# Altium schematic sheet EEG AFE Sheet.SchDoc
size 381 x 241 mm; SheetNumber: 1; SheetTotal: 3
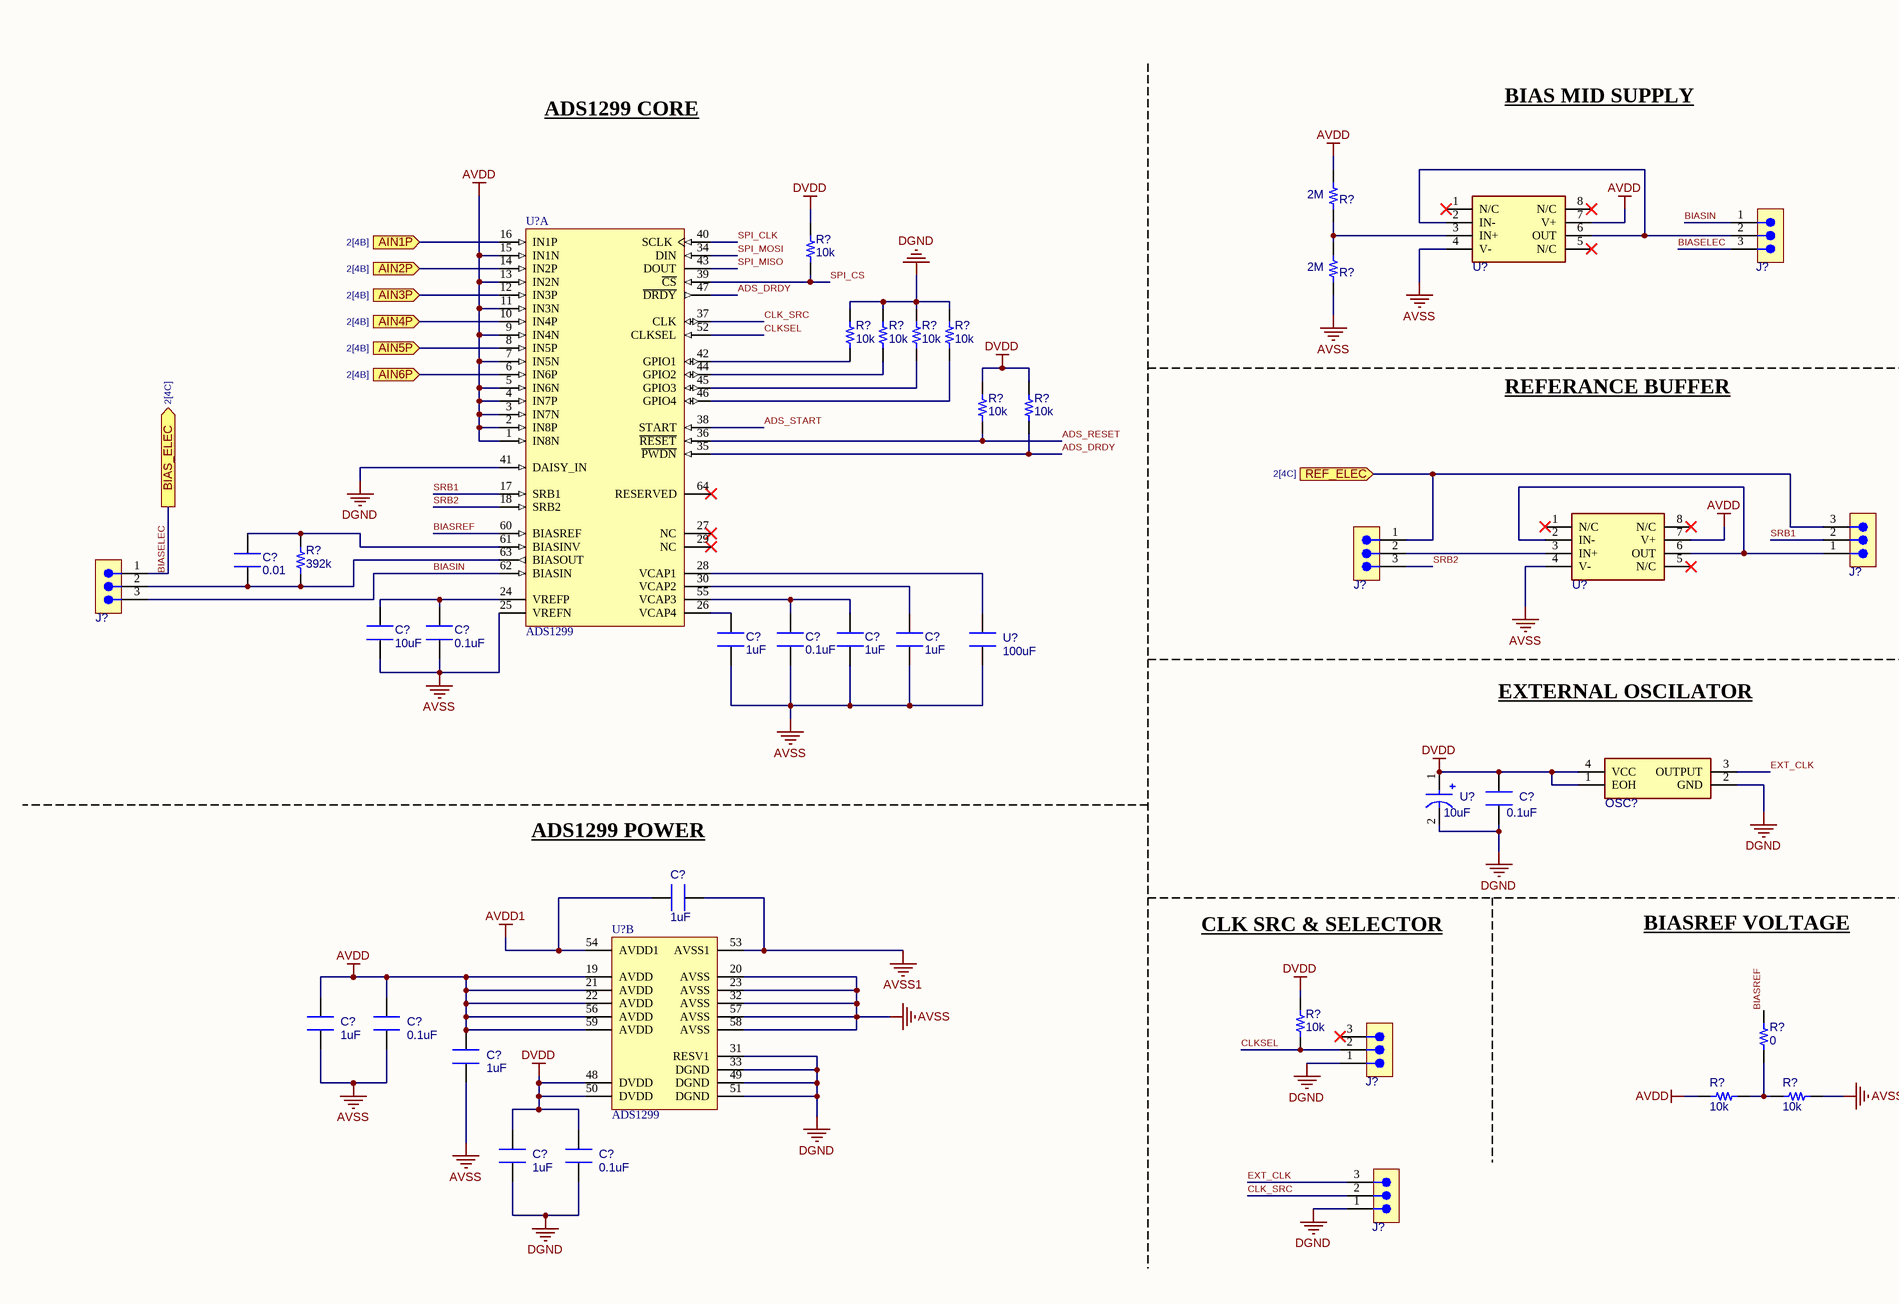
[diagram p0: EEG AFE Sheet.SchDoc, left]
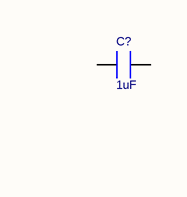
[diagram p1: EEG AFE Sheet.SchDoc, right]

## Parts
(Parts that share a designator on the sheet are numbered #1, #2 ... from top to bottom, then left to right.)
C?#1  1uF  [CAP0805]
C?#2  0.01  [CAP0805]
C?#3  10uF  [CAP0805]
C?#4  0.1uF  [CAP0805]
C?#5  1uF  [CAP0805]
C?#6  0.1uF  [CAP0805]
C?#7  1uF  [CAP0805]
C?#8  1uF  [CAP0805]
C?#9  0.1uF  [CAP0805]
C?#10  1uF  [CAP0805]
C?#11  1uF  [CAP0805]
C?#12  0.1uF  [CAP0805]
C?#13  1uF  [CAP0805]
C?#14  1uF  [CAP0805]
C?#15  0.1uF  [CAP0805]
J?#1  *  [SMTC-TSW-103-07-X-S]  (value not drawn)
J?#2  *  [SMTC-TSW-103-07-X-S]  (value not drawn)
J?#3  *  [SMTC-TSW-103-07-X-S]  (value not drawn)
J?#4  *  [SMTC-TSW-103-07-X-S]  (value not drawn)
J?#5  *  [SMTC-TSW-103-07-X-S]  (value not drawn)
J?#6  *  [SMTC-TSW-103-07-X-S]  (value not drawn)
OSC?  *  [632L3I002M04800]  (value not drawn)
R?#1  2M  [RES0805]
R?#2  10k  [RES0805]
R?#3  2M  [RES0805]
R?#4  10k  [RES0805]
R?#5  10k  [RES0805]
R?#6  10k  [RES0805]
R?#7  10k  [RES0805]
R?#8  10k  [RES0805]
R?#9  10k  [RES0805]
R?#10  392k  [RES0805]
R?#11  10k  [RES0805]
R?#12  0  [RES0805]
R?#13  10k  [RES0805]
R?#14  10k  [RES0805]
U?#1  *  [SOIC127P600X175-8N]  (value not drawn)
U?#2  ADS1299  [TI-PAG64_N]  (part A of 2)
U?#3  *  [SOIC127P600X175-8N]  (value not drawn)
U?#4  100uF  [CAP1210]
U?#5  10uF  [CAPC0805_TANT]
U?#6  ADS1299  [TI-PAG64_N]  (part B of 2)

## Ports
AIN1P (in, see 2[4B]), AIN2P (in, see 2[4B]), AIN3P (in, see 2[4B]), AIN4P (in, see 2[4B]), AIN5P (in, see 2[4B]), AIN6P (in, see 2[4B]), BIAS_ELEC (out, see 2[4C]), REF_ELEC (in, see 2[4C])

## Nets
AVDD: C?#11.2 C?#12.2 C?#13.2 R?#1.2 R?#13.2 U?#1.7(V+) U?#2.1(IN8N) U?#2.2(IN8P) U?#2.3(IN7N) U?#2.4(IN7P) U?#2.5(IN6N) U?#2.7(IN5N) U?#2.9(IN4N) U?#2.11(IN3N) U?#2.13(IN2N) U?#2.15(IN1N) U?#3.7(V+) U?#6.19(AVDD) U?#6.21(AVDD) U?#6.22(AVDD) U?#6.56(AVDD) U?#6.59(AVDD)
AVDD1: C?#10.2 U?#6.54(AVDD1)
AVSS: C?#3.2 C?#4.2 C?#5.2 C?#6.2 C?#7.2 C?#8.2 C?#11.1 C?#12.1 C?#13.1 R?#3.1 R?#14.1 U?#1.4(V-) U?#2.25(VREFN) U?#3.4(V-) U?#4.1 U?#6.20(AVSS) U?#6.23(AVSS) U?#6.32(AVSS) U?#6.57(AVSS) U?#6.58(AVSS)
AVSS1: C?#10.1 U?#6.53(AVSS1)
DGND: C?#9.1 C?#14.1 C?#15.1 J?#5.1 J?#6.1 OSC?.2(GND) R?#4.2 R?#5.2 R?#6.2 R?#7.2 U?#2.41(DAISY_IN) U?#5.2(A) U?#6.31(RESV1) U?#6.33(DGND) U?#6.49(DGND) U?#6.51(DGND)
DVDD: C?#9.2 C?#14.2 C?#15.2 OSC?.1(EOH) OSC?.4(VCC) R?#2.2 R?#8.1 R?#9.1 R?#11.2 U?#5.1(C) U?#6.48(DVDD) U?#6.50(DVDD)
ADS_DRDY: R?#9.2 U?#2.35(~{PWDN}) U?#2.47(~{DRDY})
ADS_RESET: R?#8.2 U?#2.36(~{RESET})
ADS_START: U?#2.38(START)
AIN1P: U?#2.16(IN1P) ; port AIN1P
AIN2P: U?#2.14(IN2P) ; port AIN2P
AIN3P: U?#2.12(IN3P) ; port AIN3P
AIN4P: U?#2.10(IN4P) ; port AIN4P
AIN5P: U?#2.8(IN5P) ; port AIN5P
AIN6P: U?#2.6(IN6P) ; port AIN6P
BIASELEC: J?#1.3 J?#4.1 ; port BIAS_ELEC
BIASIN: J?#1.1 J?#4.3 U?#2.62(BIASIN)
BIASREF: R?#12.1 U?#2.60(BIASREF)
CLK_SRC: J?#6.2 U?#2.37(CLK)
CLKSEL: J?#5.2 R?#11.1 U?#2.52(CLKSEL)
EXT_CLK: J?#6.3 OSC?.3(OUTPUT)
REF_ELEC: J?#2.3 J?#3.1 ; port REF_ELEC
SPI_CLK: U?#2.40(SCLK)
SPI_CS: R?#2.1 U?#2.39(~{CS})
SPI_MISO: U?#2.43(DOUT)
SPI_MOSI: U?#2.34(DIN)
SRB1: J?#2.2 U?#2.17(SRB1)
SRB2: J?#3.3 U?#2.18(SRB2)
NetC?#2_1: C?#2.1 R?#10.1 U?#2.61(BIASINV)
NetC?#2_2: C?#2.2 J?#4.2 R?#10.2 U?#2.63(BIASOUT)
NetC?#3_1: C?#3.1 C?#4.1 U?#2.24(VREFP)
NetC?#5_1: C?#5.1 U?#2.26(VCAP4)
NetC?#6_1: C?#6.1 C?#7.1 U?#2.55(VCAP3)
NetC?#8_1: C?#8.1 U?#2.30(VCAP2)
NetJ?#1_2: J?#1.2 U?#1.2(IN-) U?#1.6(OUT)
NetJ?#2_1: J?#2.1 U?#3.2(IN-) U?#3.6(OUT)
NetJ?#3_2: J?#3.2 U?#3.3(IN+)
NetR?#1_1: R?#1.1 R?#3.2 U?#1.3(IN+)
NetR?#4_1: R?#4.1 U?#2.42(GPIO1)
NetR?#5_1: R?#5.1 U?#2.44(GPIO2)
NetR?#6_1: R?#6.1 U?#2.45(GPIO3)
NetR?#7_1: R?#7.1 U?#2.46(GPIO4)
NetR?#12_2: R?#12.2 R?#13.1 R?#14.2
NetU?#2_28: U?#2.28(VCAP1) U?#4.2

Not connected (* = marked no-connect by the designer): C?#1 1 2; J?#5 3*; U?#1 1(N/C)* 5(N/C)* 8(N/C)*; U?#2 27(NC)* 29(NC)* 64(RESERVED)*; U?#3 1(N/C)* 5(N/C)* 8(N/C)*

## Notes on the sheet
- ADS1299 CORE
- BIAS MID SUPPLY
- REFERANCE BUFFER
- EXTERNAL OSCILATOR
- ADS1299 POWER
- CLK SRC & SELECTOR
- BIASREF VOLTAGE

## Library data of the parts
C?#1-C?#15 = 08055C104KAT2A: Ceramic Capacitor, Multilayer, Ceramic, 50V, 10% +Tol, 10% -Tol, X7R, 15% TC, 0.1uF, Surface Mount, 0805; Manufacturer: ???; Capacitance: 100nF; Multilayer: Yes; Package: CAP0805; Part Number: *; Value: *; Voltage: *; Tolerance: *; ComponentLink1Description: Datasheet; Current Rating: *; Supplier 1: Mouser; Manufacturer Part Number: 08055C104KAT2A; RoHS: Yes; Category: Ceramic Capacitors; Stock 1: 1865681; Pricing 1: 1=0.1, 10=0.037, 50=0.037, 100=0.022, 1000=0.017, 10000=0.013 (USD); Mount: Surface Mount; Number of Pins: 2; Dielectric Material: Ceramic; Package Shape: Rectangular; Size Code: 0805; Terminal Finish: Nickel; Min Operating Temperature: -55°C; Max Operating Temperature: 125°C; JESD-609 Code: e3; Capacitor Type: Ceramic; Negative Tolerance: 10%; Package Style: SMTMeter; Packaging: Tape and Reel; Positive Tolerance: 10%; Rated DC Voltage (URdc): 50V; Temperature Characteristics Code: X7R; Termination: Wraparound; Length: 2.01mm; Width: 1.25mm; Height: 0.94mm; Reach SVHC Compliant: Yes; RoHS Compliant: Yes; ComponentLink2URL: https://datasheet.ciiva.com:443/pdfs/VipMasterIC/IC/AVXC/AVXC-S-A0009640452/AVXC-S-A0009640452-1.pdf?src-supplier=IHS+Markit; ComponentLink2Description: https://datasheet.ciiva.com:443/pdfs/VipMasterIC/IC/AVXC/AVXC-S-A0009640452/AVXC-S-A0009640452-1.pdf?src-supplier=IHS+Markit; ComponentLink3URL: https://datasheet.ciiva.com/19475/2009691-19475858.pdf?src-supplier=Jameco; ComponentLink3Description: https://datasheet.ciiva.com/19475/2009691-19475858.pdf?src-supplier=Jameco; ComponentLink4URL: https://datasheet.ciiva.com/11786/0900766b802d4698-11786116.pdf?src-supplier=Rs; ComponentLink4Description: https://datasheet.ciiva.com/11786/0900766b802d4698-11786116.pdf?src-supplier=Rs; ComponentLink5URL: https://datasheet.ciiva.com/2988/cx7r-2988014.pdf?src-supplier=Avnet; ComponentLink5Description: https://datasheet.ciiva.com/2988/cx7r-2988014.pdf?src-supplier=Avnet; ComponentLink6URL: https://datasheet.ciiva.com/16199/cx7r-16199014.pdf?src-supplier=Future+Electronics; ComponentLink6Description: https://datasheet.ciiva.com/16199/cx7r-16199014.pdf?src-supplier=Future+Electronics; ComponentLink7URL: https://datasheet.ciiva.com/11504/cx7r-11504044.pdf?src-supplier=Avnet; ComponentLink7Description: https://datasheet.ciiva.com/11504/cx7r-11504044.pdf?src-supplier=Avnet; ComponentLink8URL: https://datasheet.ciiva.com/150/cx7r-150258.pdf?src-supplier=Digi-Key; ComponentLink8Description: https://datasheet.ciiva.com/150/cx7r-150258.pdf?src-supplier=Digi-Key; ComponentLink9URL: https://datasheet.ciiva.com/150/cx7r-150257.pdf?src-supplier=Digi-Key; ComponentLink9Description: https://datasheet.ciiva.com/150/cx7r-150257.pdf?src-supplier=Digi-Key; ComponentLink10URL: https://datasheet.ciiva.com/150/cx7r-150259.pdf?src-supplier=Digi-Key; ComponentLink10Description: https://datasheet.ciiva.com/150/cx7r-150259.pdf?src-supplier=Digi-Key; ComponentLink11URL: https://datasheet.ciiva.com/7812/cx7r-7812079.pdf?src-supplier=Element14; ComponentLink11Description: https://datasheet.ciiva.com/7812/cx7r-7812079.pdf?src-supplier=Element14; ComponentLink12URL: https://datasheet.ciiva.com/5416/cx7r-5416959.pdf?src-supplier=Mouser; ComponentLink12Description: https://datasheet.ciiva.com/5416/cx7r-5416959.pdf?src-supplier=Mouser; Supplier Part Number 1: 581-08055C104K
J?#1-J?#6 = TSW-103-07-T-S: Board Connector, 3 Contact(s), 1 Row(s), Male, Straight, 0.1 inch Pitch, Solder Terminal, Black Insulator, Receptacle; Manufacturer: ???; Option: General Purpose; Additional Feature: E.L.P.; Contact Pattern: RECTANGULAR; Contact Style: SQ PIN-SKT; Filter Feature: No; Mating Information: MULTIPLE MATING PARTS AVAILABLE; Number Of Connectors: 1; Number of Contacts: 3; Reference Standard: UL; Reliability: COMMERCIAL; Package: SMTC-TSW-103-07-X-S; Publisher: Paraqum Technologies; Part Number: *; Value: *; Voltage: *; Tolerance: *; ComponentLink1Description: Datasheet; Current Rating: *; Supplier 1: Mouser; Manufacturer Part Number: TSW-103-07-T-S; RoHS: Yes; Category: Connectors; Stock 1: 150268; Pricing 1: 1=0.27, 10=0.235, 50=0.235, 100=0.179, 1000=0.124, 10000=0.123 (USD); Mount: Board; Contact Material: Bronze; Contact Finish - Mating: MATTE TIN OVER NICKEL (50); Contact Finish - Termination: Tin (Sn) - with Nickel (Ni) barrier; Insulation Color: Black; Insulation Material: Glass; Connector Type: BOARD CONNECTOR; JESD-609 Code: e3; Body/Shell Style: RECEPTACLE; Contact Gender: Male; Mixed Contacts: No; Mounting Style: STRAIGHT; Number Of PCB Rows: 1; Number of Rows Loaded: 1; PCB Contact Pattern: RECTANGULAR; Termination: Solder; Body Breadth: 0.1inch; Body Depth: 0.1inch; Mating Contact Pitch: 0.1inch; Terminal Length: 0.1inch; Terminal Pitch: 2.54mm; Flammability Rating: UL94 V-0; Reach SVHC Compliant: Yes; RoHS Compliant: Yes; DIN Conformance: No; IEC Conformance: No; MIL Conformance: No; ComponentLink2URL: https://datasheet.ciiva.com:443/pdfs/VipMasterIC/IC/SAMI/SAMI-S-A0003531373/SAMI-S-A0003531373-1.pdf?src-supplier=IHS+Markit; ComponentLink2Description: https://datasheet.ciiva.com:443/pdfs/VipMasterIC/IC/SAMI/SAMI-S-A0003531373/SAMI-S-A0003531373-1.pdf?src-supplier=IHS+Markit; ComponentLink3URL: https://datasheet.ciiva.com/6890/tsw-xxx-xx-xxx-x-xx-xxx-mkt-6890268.pdf?src-supplier=Digi-Key; ComponentLink3Description: https://datasheet.ciiva.com/6890/tsw-xxx-xx-xxx-x-xx-xxx-mkt-6890268.pdf?src-supplier=Digi-Key; Supplier Part Number 1: 200-TSW10307TS
OSC? = 632L3I002M04800: Standard Clock Oscillators 2.048MHz 3.3V 50ppm; Manufacturer: ???; Package: 632L3I002M04800; Publisher: Paraqum Technologies; Part Number: *; Value: *; Voltage: *; Tolerance: *; ComponentLink1Description: Datasheet; Current Rating: *; Supplier 1: Mouser; Manufacturer Part Number: 632L3I002M04800; RoHS: Yes; Category: Oscillators; Stock 1: 5448; Pricing 1: 1=1.4, 10=1.31, 50=1.31, 100=1.13, 1000=0.919, 10000=0.843 (USD); ComponentLink2URL: http://www.ctscorp.com/wp-content/uploads/2015/11/008-0328-0.pdf?src-supplier=Digi-Key; ComponentLink2Description: http://www.ctscorp.com/wp-content/uploads/2015/11/008-0328-0.pdf?src-supplier=Digi-Key; ComponentLink3URL: http://www.ctscorp.com/wp-content/uploads/2015/11/008-0328-0.pdf?src-supplier=Avnet; ComponentLink3Description: http://www.ctscorp.com/wp-content/uploads/2015/11/008-0328-0.pdf?src-supplier=Avnet; ComponentLink4URL: http://www.ctscorp.com/CHN/components/Datasheets/008-0328-0_A.pdf?src-supplier=Mouser; ComponentLink4Description: http://www.ctscorp.com/CHN/components/Datasheets/008-0328-0_A.pdf?src-supplier=Mouser; Supplier Part Number 1: 774-632L3I002M04800
R?#1-R?#14 = RC0805FR-0710KL: Fixed Resistor, Metal Glaze/thick Film, 0.125W, 10000ohm, 150V, 1% +/-Tol, 100ppm/Cel, Surface Mount, 0805; Manufacturer: ???; Additional Feature: LASER TRIMMABLE; Rated Power Dissipation (P): 125mW; Rated Temperature: 70°C; Resistance: 10kR; Temperature Coefficient: 100ppm/°C; Package Height: 0.5mm; Package Length: 2mm; Package Width: 1.25mm; Package: RES0805; Publisher: Paraqum Technologies; Part Number: *; Value: *; Voltage: *; Tolerance: *; ComponentLink1Description: Datasheet; Current Rating: *; Supplier 1: Mouser; Manufacturer Part Number: RC0805FR-0710KL; RoHS: Yes; Category: Chip SMD Resistors; Stock 1: 8413916; Pricing 1: 1=0.1, 10=0.034, 50=0.034, 100=0.014, 1000=0.007, 10000=0.004 (USD); Mount: Surface Mount; Number of Pins: 2; Package Shape: Rectangular; Size Code: 0805; Terminal Finish: Nickel; Min Operating Temperature: -55°C; Max Operating Temperature: 155°C; JESD-609 Code: e3; Termination: Wraparound; Resistor Type: FIXED RESISTOR; Construction: Chip; Package Style: SMTMeter; Packaging: Tape and Reel; Technology: METAL GLAZE/THICK FILM; Working Voltage: 150V; Reach SVHC Compliant: Yes; RoHS Compliant: Yes; ComponentLink2URL: https://datasheet.ciiva.com:443/pdfs/VipMasterIC/IC/YAGO/YAGO-S-A0008145938/YAGO-S-A0008145938-1.pdf?src-supplier=IHS+Markit; ComponentLink2Description: https://datasheet.ciiva.com:443/pdfs/VipMasterIC/IC/YAGO/YAGO-S-A0008145938/YAGO-S-A0008145938-1.pdf?src-supplier=IHS+Markit; ComponentLink3URL: https://datasheet.ciiva.com/46447/444164-46447563.pdf?src-supplier=Element14; ComponentLink3Description: https://datasheet.ciiva.com/46447/444164-46447563.pdf?src-supplier=Element14; ComponentLink4URL: https://datasheet.ciiva.com/2456/pyu-r-int-thick-7-2456973.pdf?src-supplier=Digi-Key; ComponentLink4Description: https://datasheet.ciiva.com/2456/pyu-r-int-thick-7-2456973.pdf?src-supplier=Digi-Key; ComponentLink5URL: https://datasheet.ciiva.com/2456/pyu-r-int-thick-7-2456974.pdf?src-supplier=Digi-Key; ComponentLink5Description: https://datasheet.ciiva.com/2456/pyu-r-int-thick-7-2456974.pdf?src-supplier=Digi-Key; ComponentLink6URL: https://datasheet.ciiva.com/2456/pyu-r-int-thick-7-2456972.pdf?src-supplier=Digi-Key; ComponentLink6Description: https://datasheet.ciiva.com/2456/pyu-r-int-thick-7-2456972.pdf?src-supplier=Digi-Key; ComponentLink7URL: https://datasheet.ciiva.com/12669/rc0805-12669688.pdf?src-supplier=Mouser; ComponentLink7Description: https://datasheet.ciiva.com/12669/rc0805-12669688.pdf?src-supplier=Mouser; ComponentLink8URL: https://datasheet.ciiva.com/16747/rc0805-16747087.pdf?src-supplier=Future+Electronics; ComponentLink8Description: https://datasheet.ciiva.com/16747/rc0805-16747087.pdf?src-supplier=Future+Electronics; Supplier Part Number 1: 603-RC0805FR-0710KL
U?#1 U?#3 = OPA376AIDR: Operational Amplifier, 1 Func, 25uV Offset-Max, CMOS, PDSO8; Manufacturer: ???; Package Body Material: Plastic; Architecture: VOLTAGE-FEEDBACK; Average Bias Current-Max (IIB): 10pA; Common-mode Reject Ratio-Nom: 90dB; Frequency Compensation: YES; Micropower: No; Number of Functions: 1; Package Equivalence Code: SOP8,.25; Power Supplies: 2.5/5V; Slew Rate-Min: 2V/µs; Max Supply Current: 1mA; Supply Voltage Limit-Max: 7V; Supply Voltage-Nom (Vsup): 2.2V; Unity Gain BW-Nom: 5.5MHz; Voltage Gain-Min: 1000000; Qualification Status: Not Qualified; Package: SOIC127P600X175-8N; Publisher: Paraqum Technologies; Part Number: *; Value: *; Voltage: *; Tolerance: *; ComponentLink1Description: Datasheet; Current Rating: *; Supplier 1: Mouser; Manufacturer Part Number: OPA376AIDR; RoHS: Yes; Category: Amplifiers - Op Amps, Buffer, Instrumentation; Stock 1: 7475; Pricing 1: 1=1.96, 10=1.77, 50=1.67, 100=1.42, 1000=0.967, 10000=0.88 (USD); Package Code: SOP; Number of Pins: 8; Package Shape: Rectangular; Terminal Finish: Nickel; Min Operating Temperature: -40°C; Max Operating Temperature: 125°C; JESD-609 Code: e4; Amplifier Type: OPERATIONAL AMPLIFIER; Bias Current-Max (IIB) @25C: 10pA; Input Offset Voltage-Max: 25uV; JESD-30 Code: R-PDSO-G8; Low-Bias: Yes; Low-Offset: Yes; Moisture Sensitivity Level: 2; Package Style: SMALL OUTLINEMeter; Packaging: Tape and Reel; Peak Reflow Temperature (Cel): 260°C; Power: No; Programmable Power: No; Slew Rate: 2V/µs; Surface Mount: Yes; Technology: CMOS; Terminal Form: Gull Wing; Terminal Position: DUAL; Wideband: No; Length: 4.9mm; Width: 3.9mm; Height - Seated (Max): 1.75mm; Terminal Pitch: 1.27mm; Temperature Grade: AUTOMOTIVE; Reach SVHC Compliant: Yes; RoHS Compliant: Yes; ComponentLink2URL: https://www.ti.com:443/lit/ds/symlink/opa2376.pdf?src-supplier=IHS+Markit; ComponentLink2Description: https://www.ti.com:443/lit/ds/symlink/opa2376.pdf?src-supplier=IHS+Markit; ComponentLink3URL: https://datasheet.ciiva.com/1813/opa2376-1813349.pdf?src-supplier=Digi-Key; ComponentLink3Description: https://datasheet.ciiva.com/1813/opa2376-1813349.pdf?src-supplier=Digi-Key; ComponentLink4URL: https://datasheet.ciiva.com/14456/opa376-14456360.pdf?src-supplier=Avnet; ComponentLink4Description: https://datasheet.ciiva.com/14456/opa376-14456360.pdf?src-supplier=Avnet; Supplier Part Number 1: 595-OPA376AIDR
U?#2 U?#6 = TI-ADS1299-PAG-64: Analog to Digital Converters - ADC Low-Noise, 6-Channel, 24-Bit Analog-to-Digital Converter for Biopotential Measurements 64-TQFP -40 to 85; DIGIKEY: 296-34818-1-ND
U?#4 = CL32A107MPVNNNE: Ceramic Capacitor, Multilayer, Ceramic, 10V, 20% +Tol, 20% -Tol, X5R, 15% TC, 100uF, Surface Mount, 1210; Manufacturer: ???; Multilayer: Yes; Package: CAP1210; Publisher: Paraqum Technologies; Part Number: *; Value: *; Voltage: *; Tolerance: *; ComponentLink1Description: Datasheet; Current Rating: *; Supplier 1: Mouser; Manufacturer Part Number: CL32A107MPVNNNE; RoHS: Yes; Category: Ceramic Capacitors; Stock 1: 59809; Pricing 1: 1=1.07, 10=0.66, 50=0.66, 100=0.581, 1000=0.386, 10000=0.325 (USD); Mount: Surface Mount; Number of Pins: 2; Dielectric Material: Ceramic; Package Shape: Rectangular; Size Code: 1210; Terminal Finish: Nickel; Min Operating Temperature: -55°C; Max Operating Temperature: 85°C; JESD-609 Code: e3; Capacitance: 100uF; Capacitor Type: Ceramic; Negative Tolerance: 20%; Package Style: SMTMeter; Packaging: Tape and Reel; Positive Tolerance: 20%; Rated DC Voltage (URdc): 10V; Temperature Characteristics Code: X5R; Termination: Wraparound; Length: 3.2mm; Width: 2.5mm; Height: 2.8mm; Reach SVHC Compliant: Yes; RoHS Compliant: Yes; ComponentLink2URL: https://datasheet.ciiva.com:443/pdfs/VipMasterIC/IC/SEMS/SEMS-S-A0008524842/SEMS-S-A0008524698-1.pdf?src-supplier=IHS+Markit; ComponentLink2Description: https://datasheet.ciiva.com:443/pdfs/VipMasterIC/IC/SEMS/SEMS-S-A0008524842/SEMS-S-A0008524698-1.pdf?src-supplier=IHS+Markit; ComponentLink3URL: https://datasheet.ciiva.com/26947/getdatasheetpartid-468228-26947022.pdf?src-supplier=Verical; ComponentLink3Description: https://datasheet.ciiva.com/26947/getdatasheetpartid-468228-26947022.pdf?src-supplier=Verical; Supplier Part Number 1: 187-CL32A107MPVNNNE
U?#5 = TPSR105K025R4000: Tantalum Capacitor, Polarized, Tantalum (dry/solid), 25V, 10% +Tol, 10% -Tol, 1uF, Surface Mount, 0805; Manufacturer: ???; ESR (Equivalent Series Resistance): 4R; Leakage Current: 500nA; Tan Delta: 0.04; Package: CAPC0805_TANT; Publisher: Paraqum Technologies; Part Number: *; Value: *; Voltage: *; Tolerance: *; ComponentLink1Description: Datasheet; Current Rating: *; Supplier 1: Mouser; Manufacturer Part Number: TPSR105K025R4000; RoHS: Yes; Category: Tantalum Capacitors; Stock 1: 11306; Pricing 1: 1=0.93, 10=0.656, 50=0.656, 100=0.431, 1000=0.272, 10000=0.205 (USD); Mount: Surface Mount; Number of Pins: 2; Dielectric Material: Tantalum; Package Shape: Rectangular; Size Code: 0805; Terminal Finish: Nickel; Min Operating Temperature: -55°C; Max Operating Temperature: 125°C; JESD-609 Code: e3; Polarity: Polarized; Capacitance: 1uF; Capacitor Type: Tantalum; Negative Tolerance: 10%; Package Style: SMTMeter; Packaging: Tape and Reel; Positive Tolerance: 10%; Rated DC Voltage (URdc): 25V; Termination: J BEND; Length: 2.05mm; Width: 1.3mm; Height: 1.2mm; Reach SVHC Compliant: Yes; RoHS Compliant: Yes; ComponentLink2URL: https://datasheet.ciiva.com:443/pdfs/VipMasterIC/IC/AVXC/AVXC-S-A0008980848/AVXC-S-A0008980848-1.pdf?src-supplier=IHS+Markit; ComponentLink2Description: https://datasheet.ciiva.com:443/pdfs/VipMasterIC/IC/AVXC/AVXC-S-A0008980848/AVXC-S-A0008980848-1.pdf?src-supplier=IHS+Markit; ComponentLink3URL: http://www.mouser.com/ds/2/40/tps-776850.pdf?src-supplier=Mouser; ComponentLink3Description: http://www.mouser.com/ds/2/40/tps-776850.pdf?src-supplier=Mouser; ComponentLink4URL: http://global.kyocera.com/prdct/electro/pdf/capacitors/taj-ce.pdf?src-supplier=Avnet; ComponentLink4Description: http://global.kyocera.com/prdct/electro/pdf/capacitors/taj-ce.pdf?src-supplier=Avnet; ComponentLink5URL: http://datasheets.avx.com/TPS.pdf?src-supplier=Digi-Key; ComponentLink5Description: http://datasheets.avx.com/TPS.pdf?src-supplier=Digi-Key; Supplier Part Number 1: 581-TPSR105K025R4000